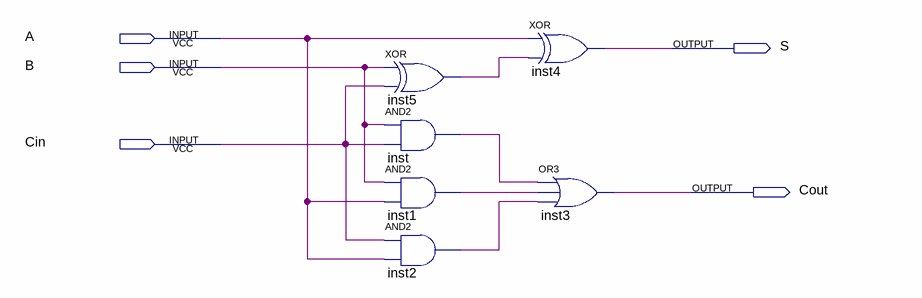
[diagram p0: schematic sheet]
// Quartus schematic Esquematico.bdf as structural Verilog: 6 symbols, 5 pins
module Esquematico (
  input  A,
  input  B,
  input  Cin,
  output S,
  output Cout
);

  wire inst1_out, inst2_out, inst5_out, inst_out;

  xor inst5 (inst5_out, B, Cin);
  and inst (inst_out, B, Cin);
  and inst1 (inst1_out, B, A);
  and inst2 (inst2_out, Cin, A);
  xor inst4 (S, A, inst5_out);
  or inst3 (Cout, inst_out, inst1_out, inst2_out);
endmodule
